# Altium schematic sheet PAC_BDD_1.SchDoc
size A4
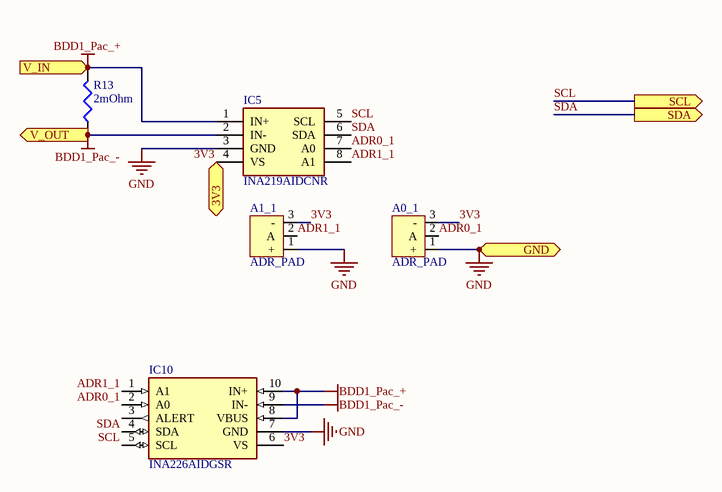
[diagram p0: PAC_BDD_1.SchDoc]

## Parts
A0_1  ADR_PAD  [SOLDER_PAD]
A1_1  ADR_PAD  [SOLDER_PAD]
IC5  INA219AIDCNR  [SOT65P280X145-8N]
IC10  INA226AIDGSR  [SOP50P490X110-10N]
R13  2mOhm  [RESC3216X75N]

## Ports
3V3 (bidir), GND (bidir), SCL (out), SDA (out), V_IN (in), V_OUT (out)

## Nets
BDD1_Pac_+: IC5.1(IN+) IC10.8(VBUS) IC10.10(IN+) R13.2 ; port V_IN
BDD1_Pac_-: IC5.2(IN-) IC10.9(IN-) R13.1 ; port V_OUT
GND: A0_1.1(+) A1_1.1(+) IC5.3(GND) IC10.7(GND) ; port GND
3V3: A0_1.3(-) A1_1.3(-) IC5.4(VS) IC10.6(VS) ; port 3V3
ADR0_1: A0_1.2(A) IC5.7(A0) IC10.2(A0)
ADR1_1: A1_1.2(A) IC5.8(A1) IC10.1(A1)
SCL: IC5.5(SCL) IC10.5(SCL) ; port SCL
SDA: IC5.6(SDA) IC10.4(SDA) ; port SDA

Not connected (* = marked no-connect by the designer): IC10 3(ALERT)

## Library data of the parts
A0_1 A1_1 = ADR_PAD: ADR PAD 3 PIN
IC5 = INA219BIDCNR: Integrated Circuit; Manufacturer_Name: Texas Instruments; Datasheet Link: http://www.ti.com/lit/ds/symlink/ina219.pdf; Height: 1.45mm; Manufacturer_Part_Number: INA219BIDCNR; Mouser Part Number: 595-INA219BIDCNR; Mouser Price/Stock: https://www.mouser.com/Search/Refine.aspx?Keyword=595-INA219BIDCNR
IC10 = INA226AIDGSR: Integrated Circuit; Manufacturer_Name: Texas Instruments; Datasheet Link: https://componentsearchengine.com/Datasheets/1/INA226AIDGSR.pdf; Height: 1.1mm; Manufacturer_Part_Number: INA226AIDGSR; Arrow Part Number: INA226AIDGSR; Arrow Price/Stock: https://www.arrow.com/en/products/ina226aidgsr/texas-instruments; Mouser Part Number: 595-INA226AIDGSR; Mouser Price/Stock: https://www.mouser.co.uk/ProductDetail/Texas-Instruments/INA226AIDGSR?qs=tQG3bEuiOZD4quG3egR36g%3D%3D
R13 = Res3: Resistor; Published: 8-Jun-2000; LatestRevisionDate: 29-May-2009; LatestRevisionNote: IPC-7351 Footprint Added.; PackageReference: J1-0603; Publisher: Altium Limited; PackageDescription: Chip Resistor; Value: 2mOhm